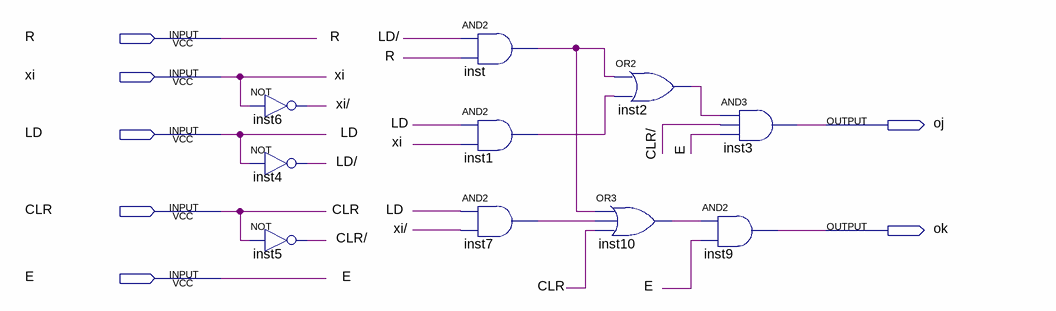
[diagram p0: schematic sheet]
// Quartus schematic transmite_entrada.bdf as structural Verilog: 10 symbols, 7 pins
module transmite_entrada (
  input  R,
  input  xi,
  input  LD,
  input  CLR,
  input  E,
  output oj,
  output ok
);

  wire \CLR/ , inst1_out, inst2_out, inst7_out, inst10_out, inst_out, \LD/ , \xi/ ;

  not inst6 (\xi/ , xi);
  not inst4 (\LD/ , LD);
  not inst5 (\CLR/ , CLR);
  and inst (inst_out, \LD/ , R);
  and inst1 (inst1_out, LD, xi);
  and inst7 (inst7_out, LD, \xi/ );
  or inst2 (inst2_out, inst_out, inst1_out);
  or inst10 (inst10_out, inst_out, inst7_out, CLR);
  and inst3 (oj, inst2_out, \CLR/ , E);
  and inst9 (ok, inst10_out, E);
endmodule
